# EAGLE schematic Electron_Qwiic (EAGLE 9.0.1)
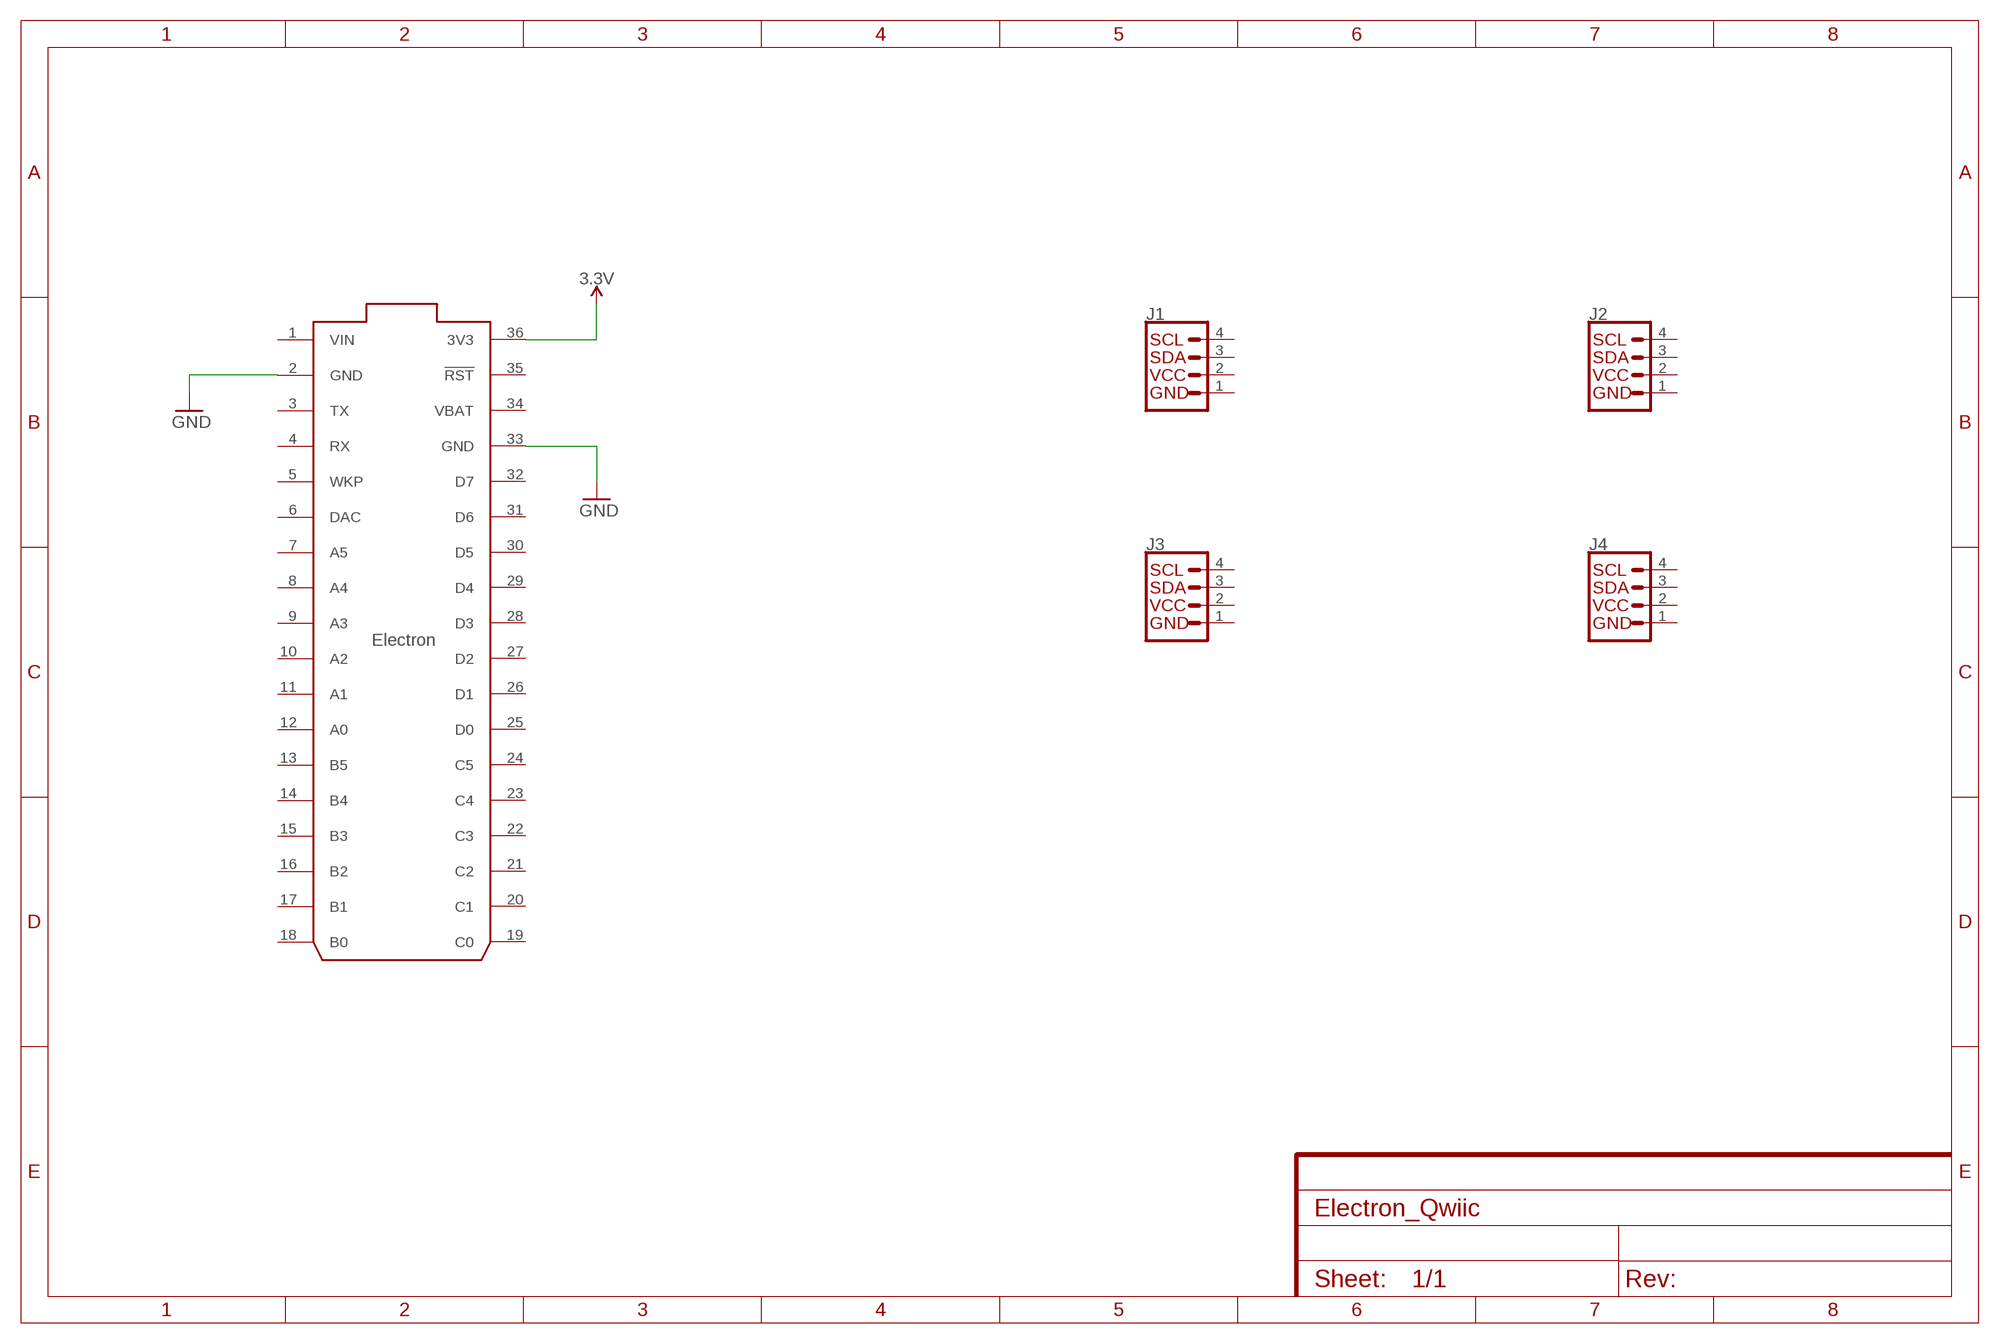
[diagram p0: schematic, sheet 1]

## Parts
J1  QWIIC_CONNECTORJS-1MM  [1X04_1MM_RA]
J2  QWIIC_CONNECTORJS-1MM  [1X04_1MM_RA]
J3  QWIIC_CONNECTORJS-1MM  [1X04_1MM_RA]
J4  QWIIC_CONNECTORJS-1MM  [1X04_1MM_RA]
U$1  ELECTRON_WITH_HEADERS  [ELECTRON]

## Nets
3.3V: U$1.36(3V3)
GND: U$1.2(GND) U$1.33(GND)
Unconnected: J1.3(SDA) J1.4(SCL) J2.3(SDA) J2.4(SCL) J3.3(SDA) J3.4(SCL) J4.3(SDA) J4.4(SCL) U$1.3(TX) U$1.4(RX) U$1.5(WKP) U$1.6(DAC) U$1.7(A5) U$1.8(A4) U$1.9(A3) U$1.10(A2) U$1.11(A1) U$1.12(A0) U$1.13(B5) U$1.14(B4) U$1.15(B3) U$1.16(B2) U$1.17(B1) U$1.18(B0) U$1.19(C0) U$1.20(C1) U$1.21(C2) U$1.22(C3) U$1.23(C4) U$1.24(C5) U$1.25(D0) U$1.26(D1) U$1.27(D2) U$1.28(D3) U$1.29(D4) U$1.30(D5) U$1.31(D6) U$1.32(D7) U$1.35(!RST)

## Power pins joined to a net without a drawn wire
GND: J1.1(GND) J2.1(GND) J3.1(GND) J4.1(GND)
VBAT: U$1.34(VBAT)
VCC: J1.2(VCC) J2.2(VCC) J3.2(VCC) J4.2(VCC)
VIN: U$1.1(VIN)

## Library data of the parts
J1-J4 = SparkFun-Connectors:QWIIC_CONNECTOR: SparkFun I2C Standard Qwiic Connector An SMD 1mm pitch JST connector makes it easy and quick (get it? Qwiic?) to connect I2C devices to each other. The Qwiic system <http://www.sparkfun.com/qwiic> enables fast and solderless connection between popular platforms and various sensors and actuators. We carry 200mm <https://www.sparkfun.com/products/14204>, 100mm <https://www.sparkfun.com/products/14205>, 50mm <https://www.sparkfun.com/products/14206>, and breadboard friendly <https://www.sparkfun.com/products/14207> Qwiic cables. We also offer 10 pcs strips <https://www.sparkfun.com/products/14323> the SMD connectors.
U$1 = Particle-Devices:ELECTRON: The Particle Electron is a tiny development kit for creating cellular-connected electronics projects and products. It comes with a SIM card (Nano 4FF) and an affordable data plan for low-bandwidth things. Design files : here <https://github.com/particle-iot/electron> Product Page : Datasheet <https://docs.particle.io/datasheets/electron-(cellular)/electron-datasheet/> Github : Particle devices library <https://github.com/particle-iot/hardware-libraries/tree/master/Eagle>